# Altium schematic sheet NodeController.SchDoc
size A3; SheetNumber: 1; SheetTotal: 1
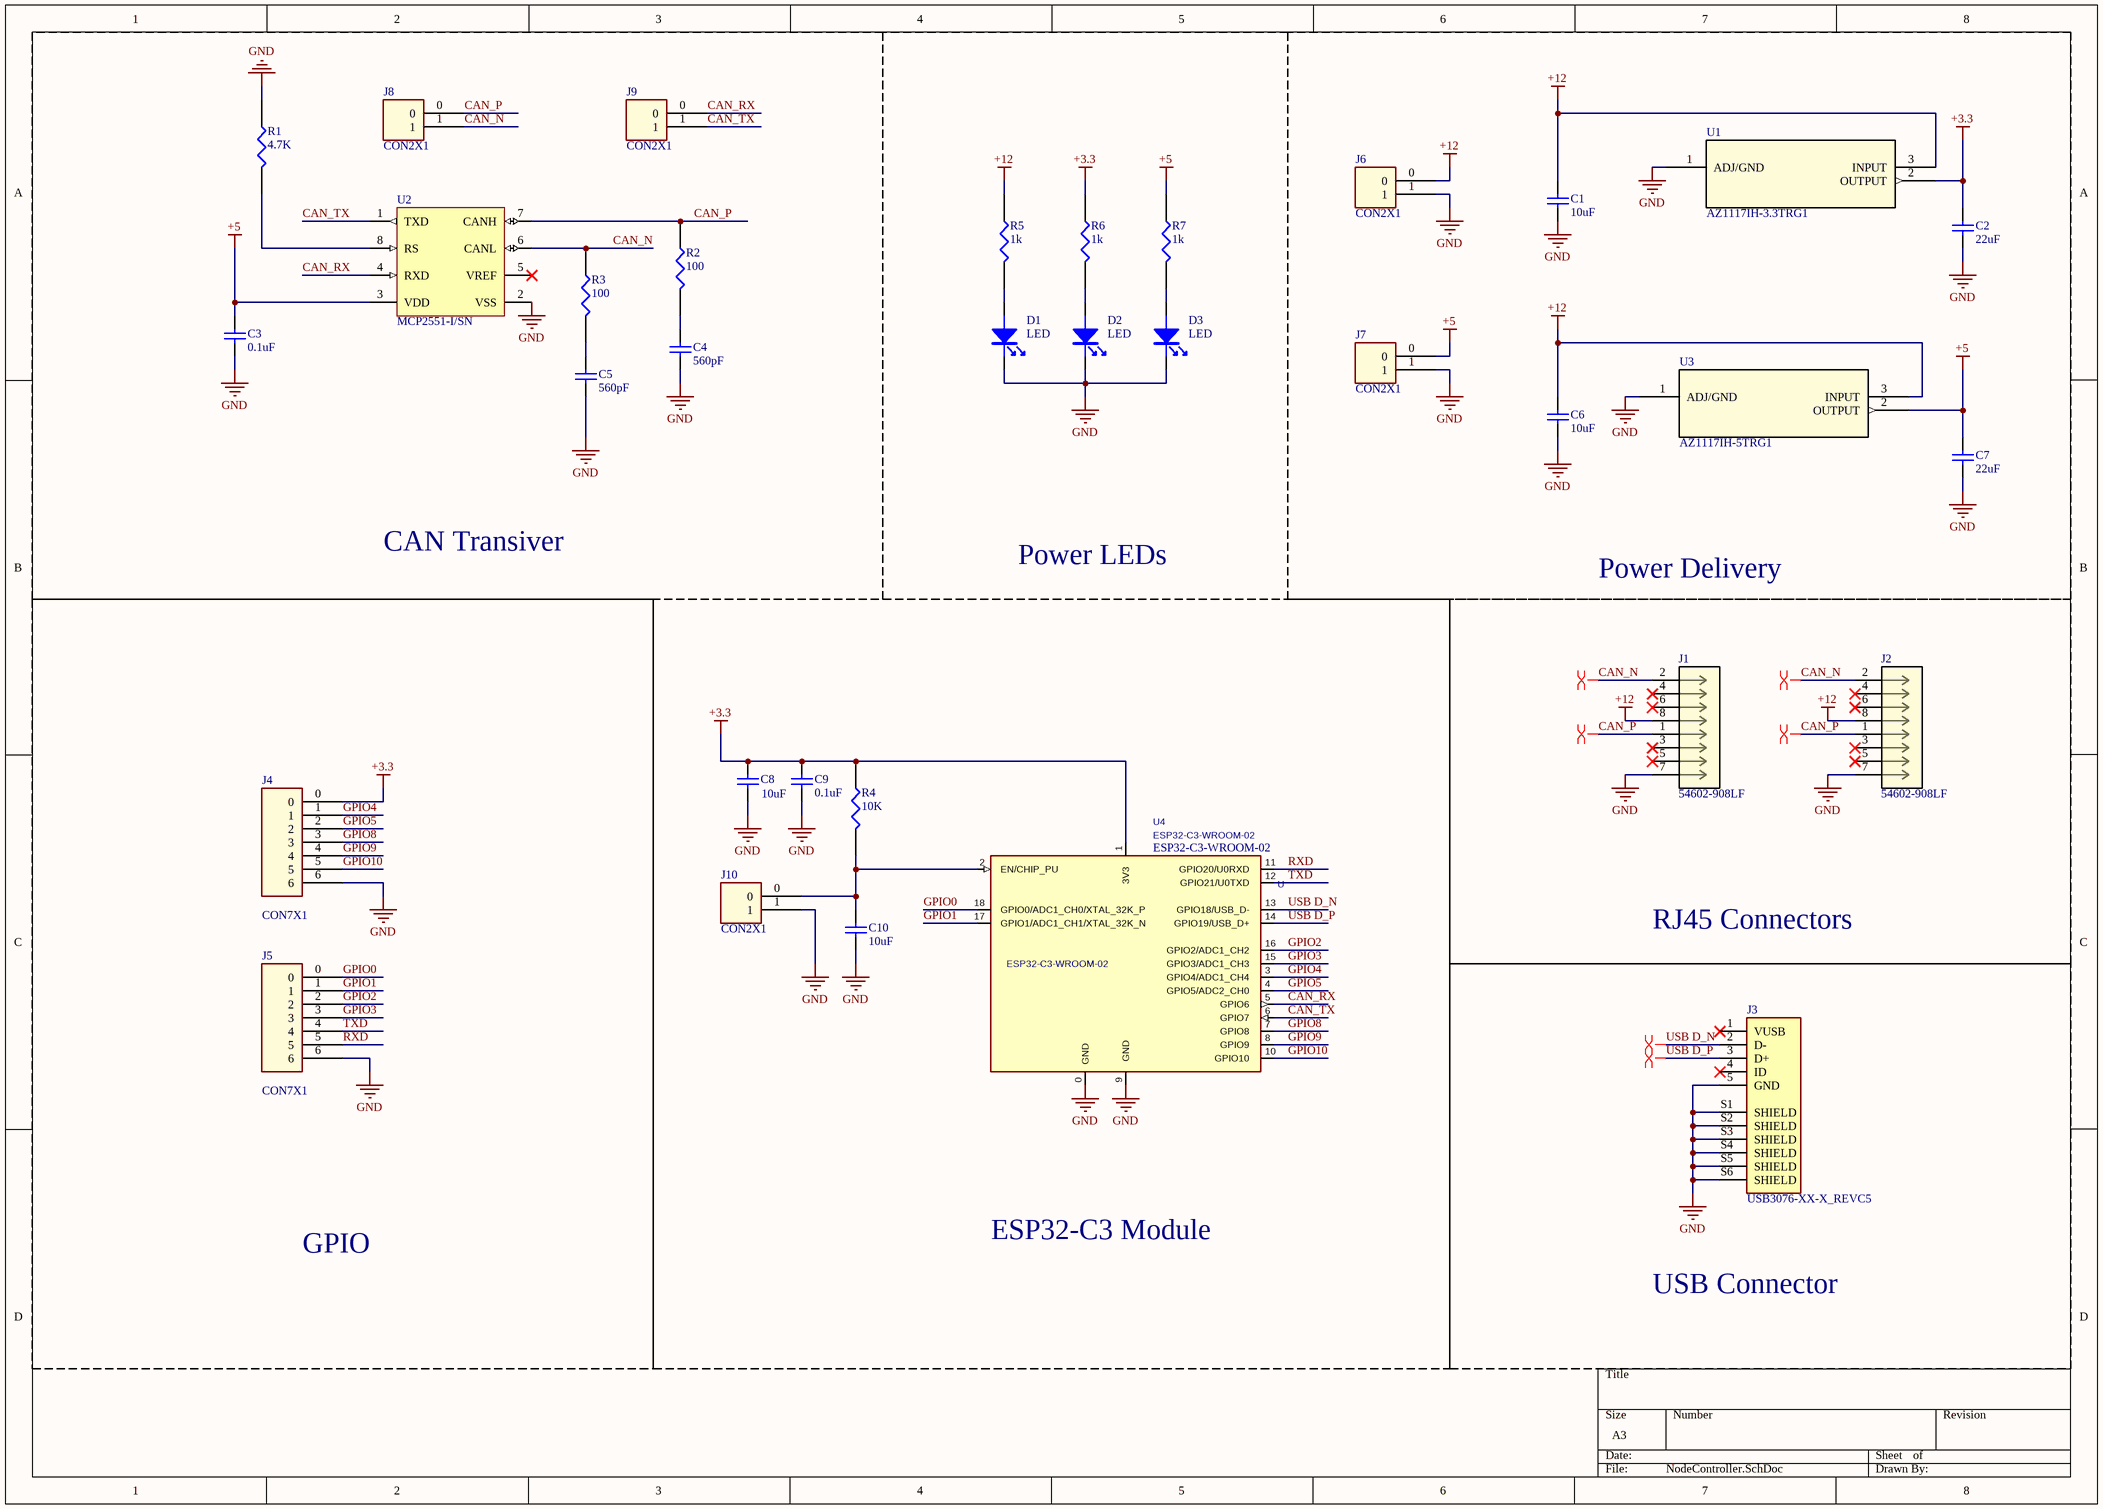
[diagram p0: NodeController.SchDoc]

## Parts
C1  10uF  [Resistor/Cap-1206]
C2  22uF  [Resistor/Cap-1206]
C3  0.1uF  [Resistor/Cap-1206]
C4  560pF  [Resistor/Cap-1206]
C5  560pF  [Resistor/Cap-1206]
C6  10uF  [Resistor/Cap-1206]
C7  22uF  [Resistor/Cap-1206]
C8  10uF  [Resistor/Cap-1206]
C9  0.1uF  [Resistor/Cap-1206]
C10  10uF  [Resistor/Cap-1206]
D1  LED  [LED-1206]
D2  LED  [LED-1206]
D3  LED  [LED-1206]
J1  54602-908LF  [AMPHENOL_54602-908LF]
J2  54602-908LF  [AMPHENOL_54602-908LF]
J3  USB3076-XX-X_REVC5  [GCT_USB3076-XX-X_REVC5]
J4  CON7X1  [CON7X1]
J5  CON7X1  [CON7X1]
J6  CON2X1  [CON2X1]
J7  CON2X1  [CON2X1]
J8  CON2X1  [CON2X1]
J9  CON2X1  [CON2X1]
J10  CON2X1  [CON2X1]
R1  4.7K  [Resistor/Cap-1206]
R2  100  [Resistor/Cap-1206]
R3  100  [Resistor/Cap-1206]
R4  10K  [Resistor/Cap-1206]
R5  1k  [Resistor/Cap-1206]
R6  1k  [Resistor/Cap-1206]
R7  1k  [Resistor/Cap-1206]
U1  AZ1117IH-3.3TRG1  [SOT230P700X185-4N]
U2  MCP2551-I/SN  [MCP2551]
U3  AZ1117IH-5TRG1  [SOT230P700X185-4N]
U4  ESP32-C3-WROOM-02  Reference: U  [MODULE_ESP32-C3-WROOM-02-H4]

## Blocks framed on the sheet
CAN Transiver: C3-C5 J8 J9 R1-R3 U2
Power LEDs: D1-D3 R5-R7
Power Delivery: C1 C2 C6 C7 J6 J7 U1 U3
GPIO: J4 J5
ESP32-C3 Module: C8-C10 J10 R4 U4
USB Connector: J3

## Nets
+3.3: C2.2 C8.1 C9.1 J4.0 R4.1 R6.1 U1.2(OUTPUT) U4.1(3V3)
+5: C3.2 C7.2 J7.0 R7.1 U2.3(VDD) U3.2(OUTPUT)
+12: C1.2 C6.2 J1.8 J2.8 J6.0 R5.1 U1.3(INPUT) U3.3(INPUT)
GND: C1.1 C2.1 C3.1 C4.2 C5.2 C6.1 C7.1 C8.2 C9.2 C10.2 D1.K D2.K D3.K J1.7 J2.7 J3.5(GND) J3.S1(SHIELD) J3.S2(SHIELD) J3.S3(SHIELD) J3.S4(SHIELD) J3.S5(SHIELD) J3.S6(SHIELD) J4.6 J5.6 J6.1 J7.1 J10.1 R1.1 U1.1(ADJ/GND) U2.2(VSS) U3.1(ADJ/GND) U4.0(GND) U4.9(GND)
CAN_N: J1.2 J2.2 J8.1 R3.1 U2.6(CANL)
CAN_P: J1.1 J2.1 J8.0 R2.1 U2.7(CANH)
CAN_RX: J9.0 U2.4(RXD) U4.5(GPIO6)
CAN_TX: J9.1 U2.1(TXD) U4.6(GPIO7)
GPIO0: J5.0 U4.18(GPIO0/ADC1_CH0/XTAL_32K_P)
GPIO1: J5.1 U4.17(GPIO1/ADC1_CH1/XTAL_32K_N)
GPIO2: J5.2 U4.16(GPIO2/ADC1_CH2)
GPIO3: J5.3 U4.15(GPIO3/ADC1_CH3)
GPIO4: J4.1 U4.3(GPIO4/ADC1_CH4)
GPIO5: J4.2 U4.4(GPIO5/ADC2_CH0)
GPIO8: J4.3 U4.7(GPIO8)
GPIO9: J4.4 U4.8(GPIO9)
GPIO10: J4.5 U4.10(GPIO10)
RXD: J5.5 U4.11(GPIO20/U0RXD)
TXD: J5.4 U4.12(GPIO21/U0TXD)
USB D_N: J3.2(D-) U4.13(GPIO18/USB_D-)
USB D_P: J3.3(D+) U4.14(GPIO19/USB_D+)
NetC4_1: C4.1 R2.2
NetC5_1: C5.1 R3.2
NetC10_1: C10.1 J10.0 R4.2 U4.2(EN/CHIP_PU)
NetD1_A: D1.A R5.2
NetD2_A: D2.A R6.2
NetD3_A: D3.A R7.2
NetR1_2: R1.2 U2.8(RS)

Not connected (* = marked no-connect by the designer): J1 3* 4* 5* 6*; J2 3* 4* 5* 6*; J3 1(VUSB)* 4(ID)*; U2 5(VREF)*

## Layout directives
differential pair: CAN_N, CAN_P, USB D_N, USB D_P

## Notes on the sheet
- RJ45 Connectors

## Library data of the parts
C1-C10 = Cap: Capacitor; Value: 100pF; Published: 8-Jun-2000; LatestRevisionDate: 17-Jul-2002; LatestRevisionNote: Re-released for DXP Platform.; PackageReference: RAD-0.3; Publisher: Altium Limited; PackageDescription: Radial Cap, Thru-Hole; 2 Leads; 0.3 in Pin Spacing
D1-D3 = LED: Light Emitting Diode LED
J1 J2 = 54602-908LF: No Description Available; Mfr_Name: Amphenol ICC; Copyright: Copyright (C) 2024 Ultra Librarian. All rights reserved.; Manufacturer_Part_Number: 54602-908LF; RefDes: RefDes; Type: DEV
J3 = 10118193-0001LF: Micro USB 2.0, Input Output Connectors, B TYPE RECEPTACLE; MF: Amphenol ICC; Value: *; MP: 10118193-0001LF; Package: None; Check_prices: https://www.snapeda.com/parts/10118193-0001LF/Amphenol+FCI/view-part/?ref=eda; Purchase-URL: https://pricing.snapeda.com/search/part/10118193-0001LF/?ref=eda; Price: None; Availability: In Stock; SnapEDA_Link: https://www.snapeda.com/parts/10118193-0001LF/Amphenol+FCI/view-part/?ref=snap
R1-R7 = RES1: Resistor
U1 = AZ1117IH-3.3TRG1_1: No Description Available; Mfr_Name: Diodes Inc; RefDes: RefDes; Type: Type
U2 = MCP2551-I/SN: High-Speed CAN Transceiver, / 1 Mb/s, 4.5 to 5.5 V, 8-Pin SOIC (SN), Industrial Temperature, RoHS, Tube; Manufacturer: Microchip; RoHSCompliant: true; PackageReference: SN8; ComponentLink1URL: http://www.microchip.com/; DatasheetVersion: Rev. F, 07/2010; ComponentLink2Description: Datasheet; ComponentLink2URL: http://ww1.microchip.com/downloads/en/DeviceDoc/21667f.pdf; ComponentLink3Description: Package Specification; PackageDescription: 8-Pin Small Outline Integrated Circuit, Body 4.9 x 3.9 mm, Pitch 1.27 mm; ComponentLink1Description: Manufacturer URL; Mounting Technology: Surface Mount; ComponentLink3URL: http://www.microchip.com/stellent/groups/techpub_sg/documents/packagingspec/en012702.pdf
U3 = AZ1117IH-5TRG1_1_1: No Description Available; Mfr_Name: Diodes Inc; RefDes: RefDes; Type: Type
U4 = ESP32-C3-WROOM-02: ki_keywords: esp32-c3 module; ki_description: ESP32-C3-WROOM-02 is a general-purpose Wi-Fi and Bluetooth LE module. This module features a rich set of peripherals and high performance, which makes it an ideal choice for smart home, industrial automation, health care, consumer electronics, etc.; Value: ESP32-C3-WROOM-02; Footprint: PCM_Espressif:ESP32-C3-WROOM-02; Datasheet: https://www.espressif.com/sites/default/files/documentation/esp32-c3-wroom-02_datasheet_en.pdf